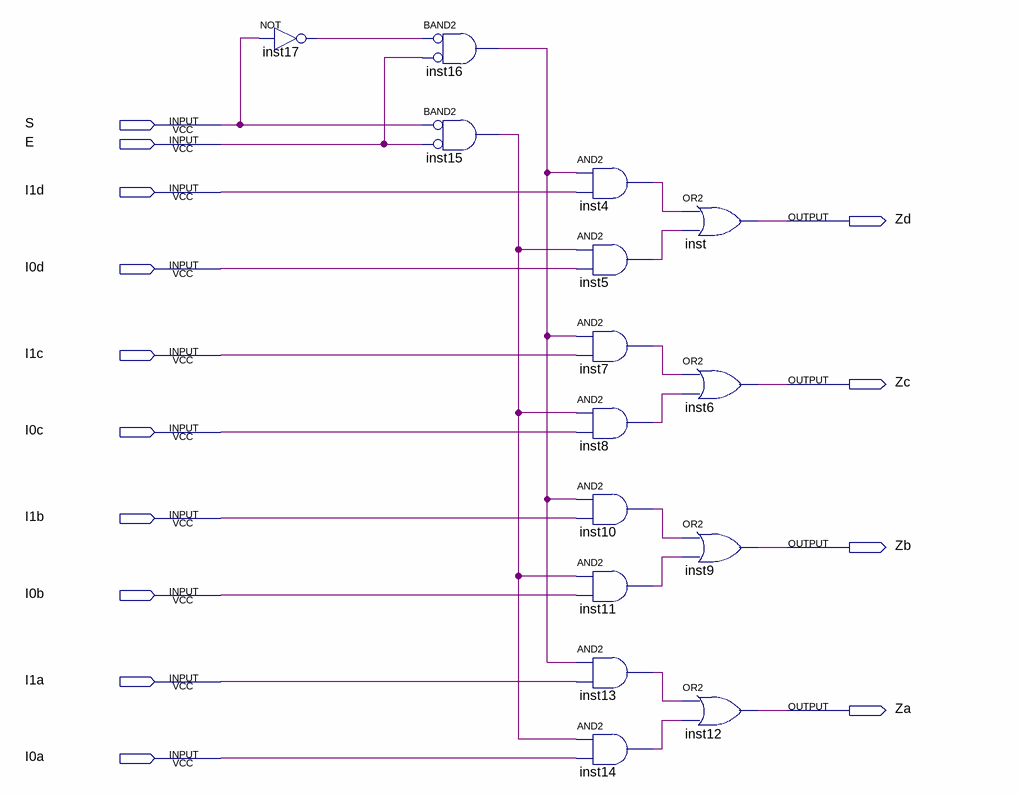
[diagram p0: schematic sheet]
// Quartus schematic CI_74LS157.bdf as structural Verilog: 15 symbols, 14 pins
module CI_74LS157 (
  input  S,
  input  E,
  input  I1d,
  input  I0d,
  input  I1c,
  input  I0c,
  input  I1b,
  input  I0b,
  input  I1a,
  input  I0a,
  output Zd,
  output Zc,
  output Zb,
  output Za
);

  wire inst4_out, inst5_out, inst7_out, inst8_out, inst10_out, inst11_out, inst13_out, inst14_out,
       inst15_out, inst16_out, inst17_out;

  not inst17 (inst17_out, S);
  and inst16 (inst16_out, ~inst17_out, ~E);  // BAND2
  and inst15 (inst15_out, ~S, ~E);  // BAND2
  and inst4 (inst4_out, inst16_out, I1d);
  and inst5 (inst5_out, inst15_out, I0d);
  and inst7 (inst7_out, inst16_out, I1c);
  and inst8 (inst8_out, inst15_out, I0c);
  and inst10 (inst10_out, inst16_out, I1b);
  and inst11 (inst11_out, inst15_out, I0b);
  and inst13 (inst13_out, inst16_out, I1a);
  and inst14 (inst14_out, inst15_out, I0a);
  or inst (Zd, inst4_out, inst5_out);
  or inst6 (Zc, inst7_out, inst8_out);
  or inst9 (Zb, inst10_out, inst11_out);
  or inst12 (Za, inst13_out, inst14_out);
endmodule
